# Altium schematic sheet Gastroscopy-Tool-Interface_Overview.SchDoc: Overview
size 279 x 215 mm; Date: not used; ApprovedBy: not used; CheckedBy: not used; Author: not used; DrawnBy: not used; Organization: not used; Address4: not used; SheetNumber: 1; SheetTotal: 4; Time: not used; ImagePath: not used; Application_BuildNumber: not used
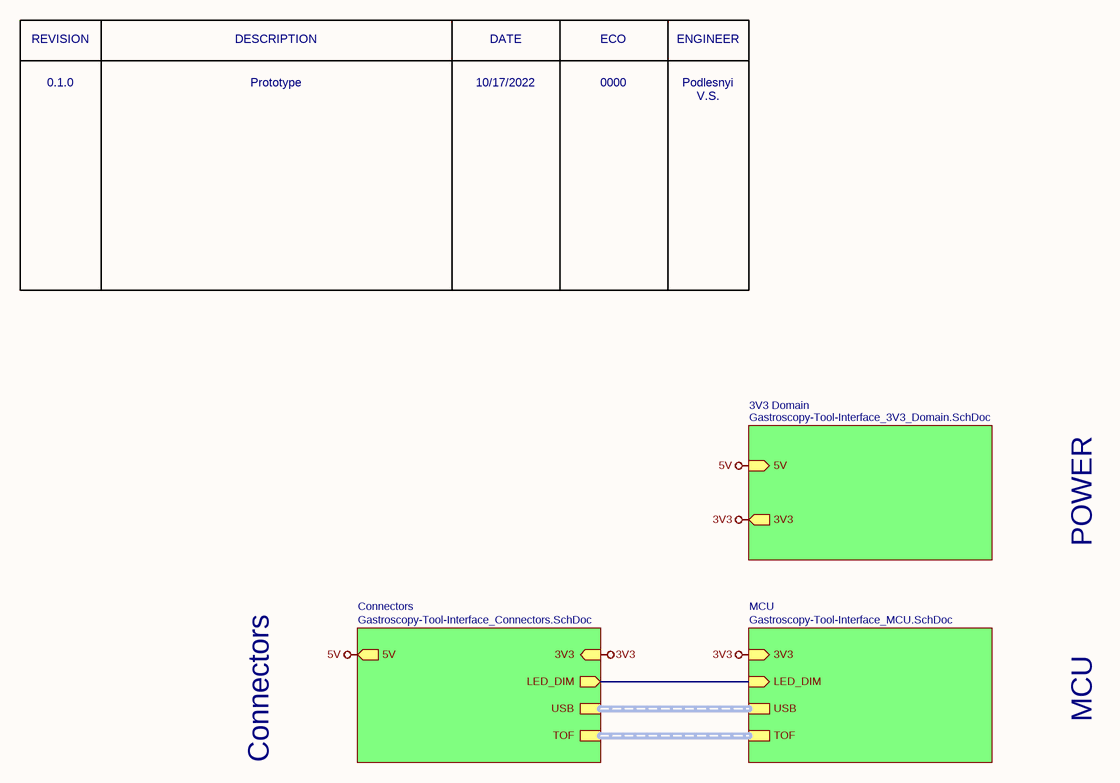
[diagram p0: Gastroscopy-Tool-Interface_Overview.SchDoc]

## Sub-sheets
3V3 Domain = Gastroscopy-Tool-Interface_3V3_Domain.SchDoc: 3V3 (out), 5V (in)
Connectors = Gastroscopy-Tool-Interface_Connectors.SchDoc: USB (harness USB), TOF (harness TOF), 5V (out), 3V3 (in), LED_DIM (out)
MCU = Gastroscopy-Tool-Interface_MCU.SchDoc: 3V3 (in), USB (harness USB), TOF (harness TOF), LED_DIM (in)

## Nets
3V3: sheet MCU/3V3, sheet Connectors/3V3, sheet 3V3 Domain/3V3
5V: sheet Connectors/5V, sheet 3V3 Domain/5V
(unnamed): sheet MCU/LED_DIM, sheet Connectors/LED_DIM

## Buses and harness runs
harness sheet Connectors/TOF = sheet MCU/TOF
harness sheet Connectors/USB = sheet MCU/USB

## Notes on the sheet
- REVISION
- DESCRIPTION
- DATE
- ECO
- ENGINEER
- 0.1.0
- Prototype
- 10/17/2022
- 0000
- Podlesnyi V.S.
- POWER
- MCU
- Connectors
- Title:
- Date:
- Size A
- Project:
- Number:
- Time:
- Sheet
- Revision
- of
- Engineer:
- www.mrobots.ru <http://mrobots.ru/>
- File: